# EAGLE design WOW Scanner (EAGLE 6.2)
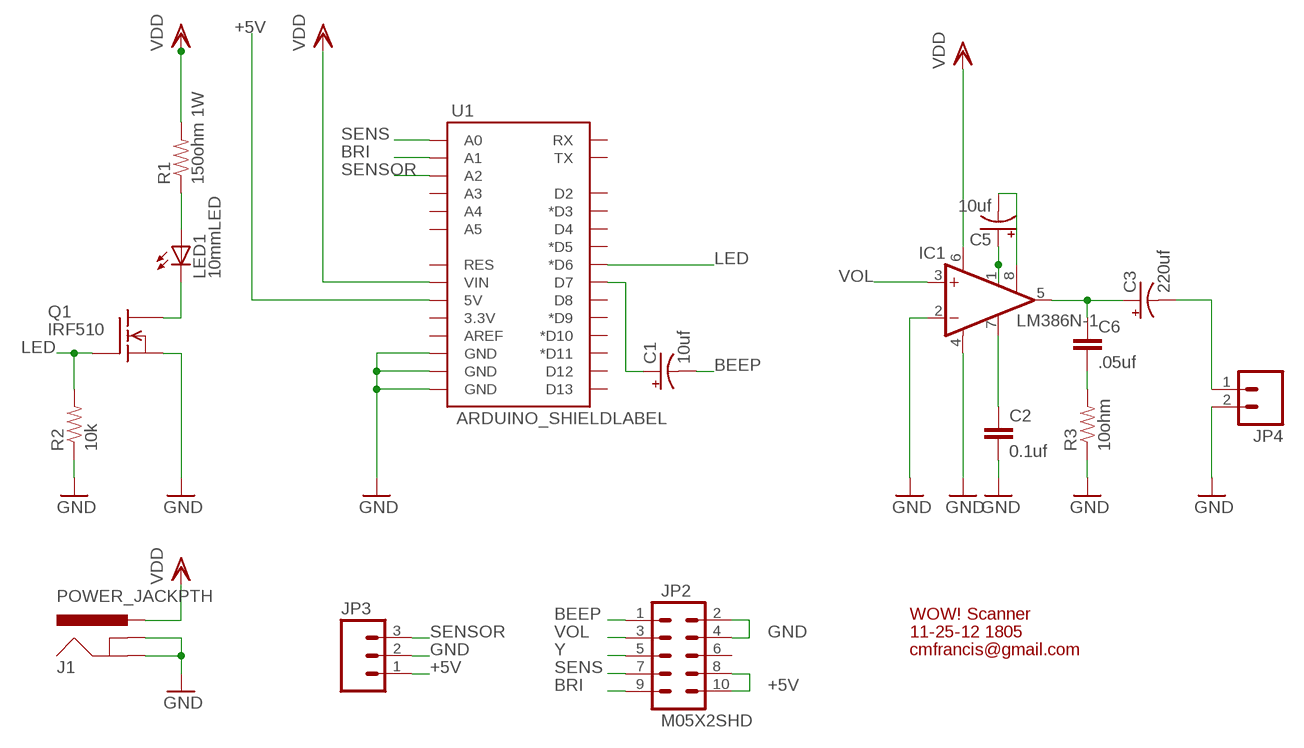
[diagram p0: schematic, sheet 1]

## Parts
C1  10uf  CAP_POLPTH2  [CPOL-RADIAL-10UF-25V]
C2  0.1uf  CAPPTH  [CAP-PTH-SMALL]
C3  220uf  CAP_POLPTH1  [CPOL-RADIAL-100UF-25V]
C5  10uf  CAP_POLPTH2  [CPOL-RADIAL-10UF-25V]
C6  .05uf  CAPPTH  [CAP-PTH-SMALL]
IC1  LM386N-1  [DIL08]
J1  POWER_JACKPTH  [POWER_JACK_PTH]
JP2  M05X2SHD  [2X5-SHROUDED]
JP3  M03JST-PTH  [JST-3-PTH]
JP4  M02PTH  [1X02]
LED1  10mmLED  LED10MM  [LED10MM]
Q1  IRF510  [TO220]
R1  150ohm 1W  RESISTORPTH-1W  [AXIAL-0.6]
R2  10k  RESISTORPTH-1/4W  [AXIAL-0.4]
R3  10ohm  RESISTORPTH-1/4W  [AXIAL-0.4]
U1  ARDUINO_SHIELDLABEL  [DUEMILANOVE_SHIELD]

## Nets
+5V: JP2.8 JP2.10 JP3.1 U1.5V
BEEP: C1.2(-) JP2.1
BRI: JP2.9 U1.A1
GND: C2.2 IC1.2(-IN) IC1.4(GND) J1.GND J1.GNDBREAK JP2.2 JP2.4 JP3.2 JP4.2 Q1.3(S) R2.P$1 R3.P$1 U1.GND@0(GND) U1.GND@1(GND) U1.GND@2(GND)
LED: Q1.1(G) R2.P$2 U1.D6(*D6)
N$1: LED1.A R1.P$1
N$2: LED1.C Q1.2(D)
N$4: C2.1 IC1.7(BYPASS)
N$5: C6.2 R3.P$2
N$6: C3.1(+) C6.1 IC1.5(OUT)
N$7: C5.1(+) IC1.1(GAIN)
N$8: C5.2(-) IC1.8(GAIN)
N$9: C3.2(-) JP4.1
N$12: C1.1(+) U1.D7
SENS: JP2.7 U1.A0
SENSOR: JP3.3 U1.A2
VDD: IC1.6(VS) J1.PWR R1.P$2 U1.VIN
VOL: IC1.3(+IN) JP2.3
Y: JP2.5
Unconnected: JP2.6 U1.3.3V U1.A3 U1.A4 U1.A5 U1.AREF U1.D2 U1.D3(*D3) U1.D4 U1.D5(*D5) U1.D8 U1.D9(*D9) U1.D10(*D10) U1.D11(*D11) U1.D12 U1.D13 U1.RES U1.RX U1.TX

## Notes on the sheet
- WOW! Scanner
- 11-25-12 1805
- cmfrancis@gmail.com

## Library data of the parts
C1 C3 C5 = SparkFun:CAP_POL: Capacitor Polarized These are standard SMD and PTH capacitors. Normally 10uF, 47uF, and 100uF in electrolytic and tantalum varieties. Always verify the external diameter of the through hole cap, it varies with capacity, voltage, and manufacturer. The EIA devices should be standard.
C2 C6 = SparkFun:CAP: Capacitor Standard 0603 ceramic capacitor, and 0.1" leaded capacitor.
IC1 = linear:LM386?-*: Low Voltage Audio Power Amplifier Source: http://cache.national.com/ds/LM/LM386.pdf
J1 = SparkFun:POWER_JACK: Power Jack This is the standard 5.5mm barrel jack for power. The PTH is the most common, proven, reliable, footprint. All others are experimental. The Slot footprint only works if the mill layer is transmitted to the PCB fab house so be warned. Spark Fun Electronics SKU : PRT-00119. Mating wall wart : TOL-00298 (and others)
JP2 = SparkFun:M05X2: Header 5x2 Standard 10-pin dual row 0.1" header. Commonly used with AVR-ISP. Use with Spark Fun Electronics SKU: PRT-00778
JP3 = SparkFun:M03: Header 3 Standard 3-pin 0.1" header. Use with straight break away headers (SKU : PRT-00116), right angle break away headers (PRT-00553), swiss pins (PRT-00743), machine pins (PRT-00117), and female headers (PRT-00115). Molex polarized connector foot print use with SKU : PRT-08232 with associated crimp pins and housings.
JP4 = SparkFun:M02: Header 2 Standard 2-pin 0.1" header. Use with straight break away headers (SKU : PRT-00116), right angle break away headers (PRT-00553), swiss pins (PRT-00743), machine pins (PRT-00117), and female headers (PRT-00115). Molex polarized connector foot print use with SKU : PRT-08233 with associated crimp pins and housings.
LED1 = SparkFun:LED: LEDs Standard schematic elements and footprints for 5mm, 3mm, 1206, and 0603 sized LEDs. 5mm - Spark Fun Electronics SKU : COM-00529 (and others)
Q1 = transistor-fet:IRF510: N-Channel Enhancement MOSFET (HEXFET); 100V; 5,6A; 0,54Ohm
R1-R3 = SparkFun:RESISTOR: Resistor Basic schematic elements and footprints for 0603, 1206, and PTH resistors.
U1 = SparkFun:ARDUINO_SHIELD

## Board
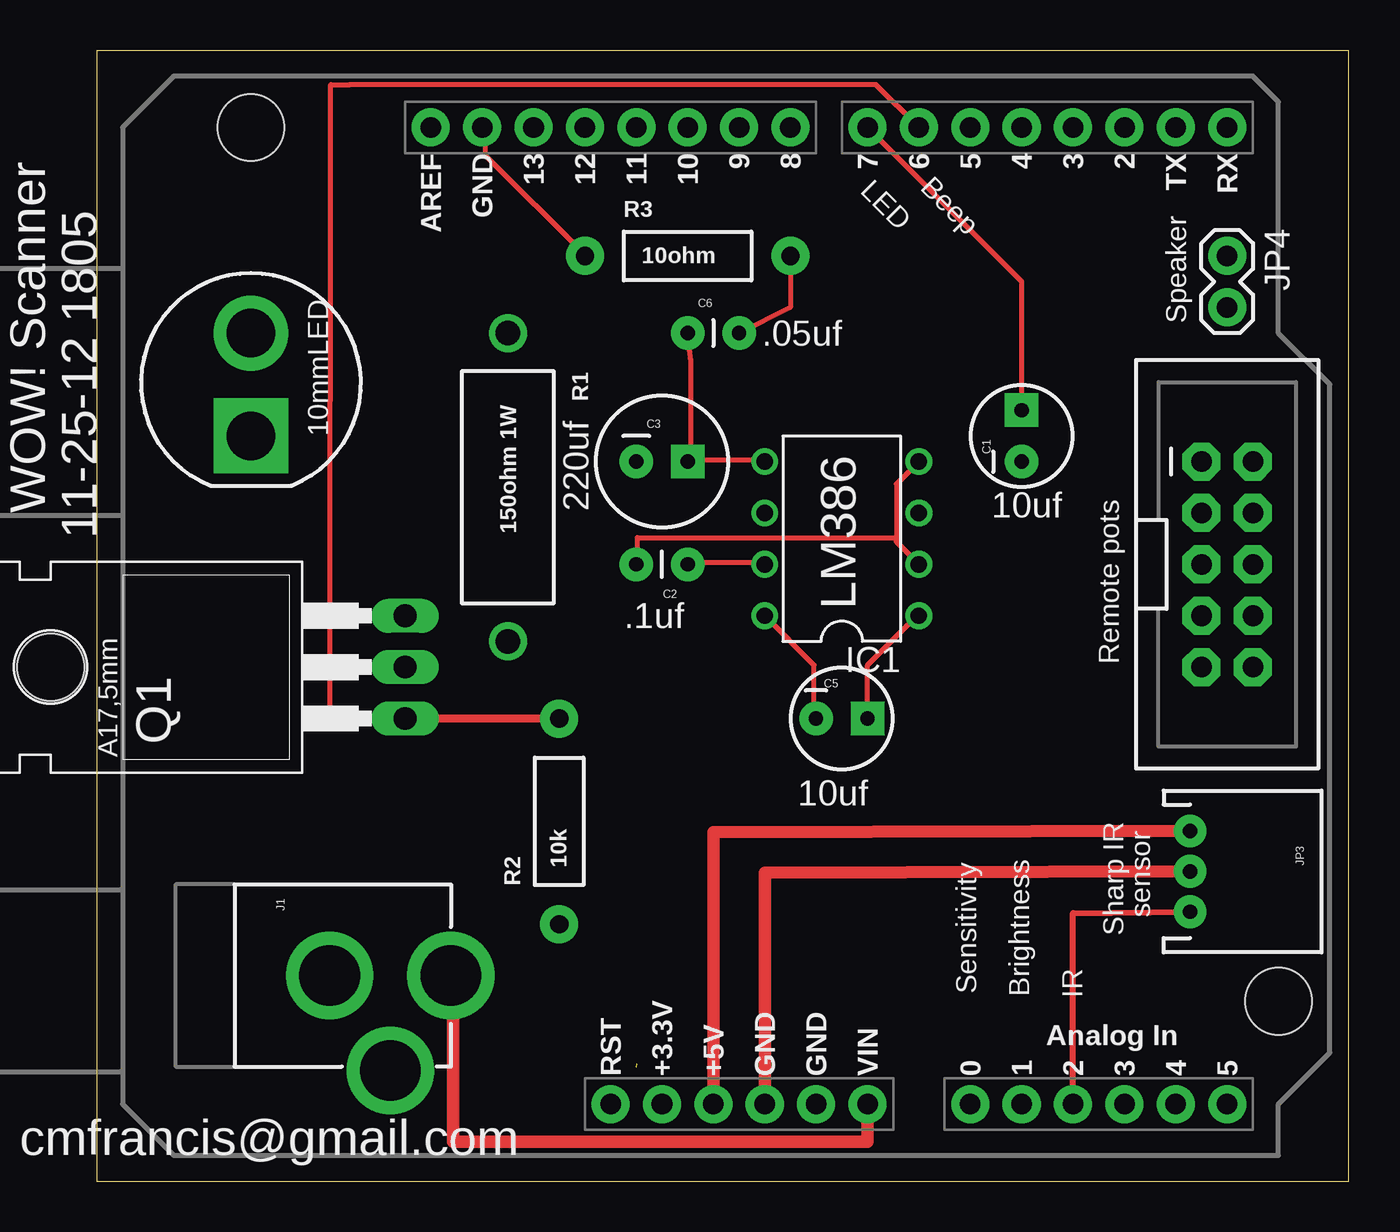
[diagram p1: board, top side]
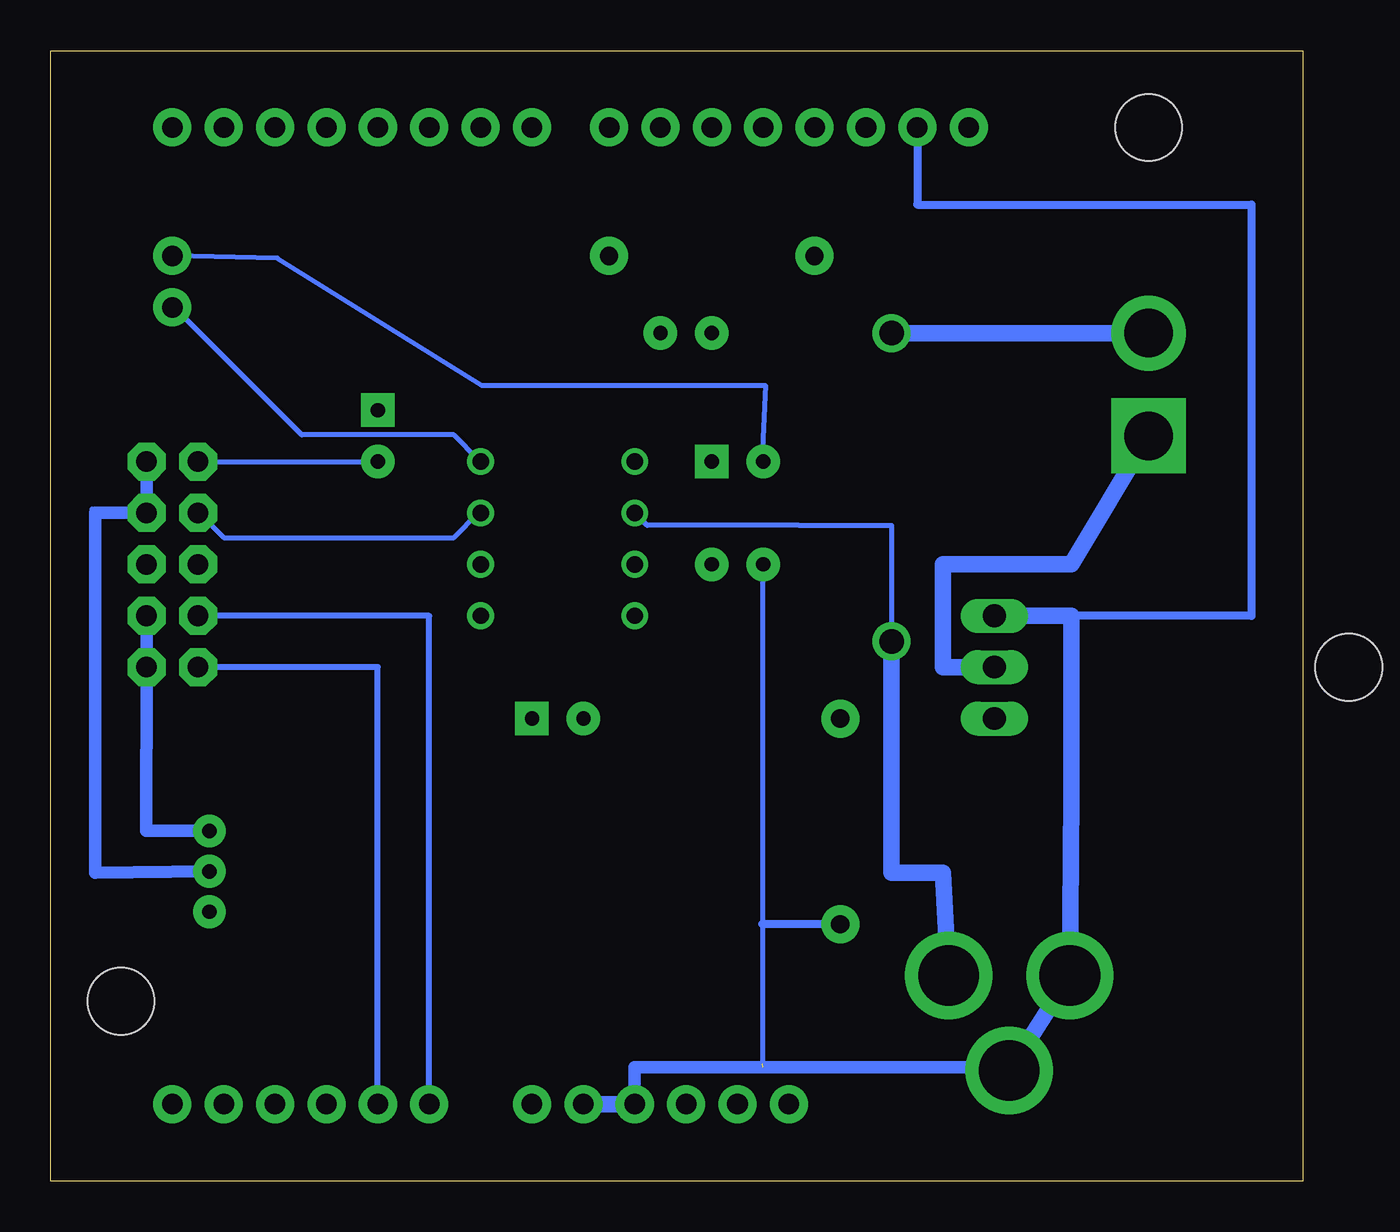
[diagram p2: board, bottom side, seen from below]

Size 61.9 x 55.87 mm. Coordinates in mm from the lower left corner, seen from the top.
Outline: 0,0 61.9,0 61.9,55.87 0,55.87 0,0
Copper layers (1*16): Top 0.035mm / dielectric 1.5mm / Bottom 0.035mm
Design rules: minimum track width 10mil, minimum drill 24mil, track to track 8mil, track to pad 8mil, pad to pad 8mil, via to via 8mil, smd to smd 8mil, copper to edge 40mil, drill to drill 8mil, minimum pad ring 10mil, minimum via ring 8mil, stop-mask expansion 4mil, vias tented up to drill 0mil, thermal gap 10mil

### Footprints (pad centres in the part's own frame; a part is rotated, then mirrored left to right if it is on the bottom)
CPOL-RADIAL-10UF-25V = drill 0.7 pad 1.651 square: 1 1.27,0 | drill 0.7 pad 1.651: 2 -1.27,0
CAP-PTH-SMALL = drill 0.7 pad 1.651: 1 0,0; 2 2.54,0
CPOL-RADIAL-100UF-25V = drill 0.7 pad 1.651 square: 1 1.27,0 | drill 0.7 pad 1.651: 2 -1.27,0
DIL08 = drill 0.813 pad 1.27: 1 -3.81,-3.81; 2 -1.27,-3.81; 3 1.27,-3.81; 4 3.81,-3.81; 5 3.81,3.81; 6 1.27,3.81; 7 -1.27,3.81; 8 -3.81,3.81
POWER_JACK_PTH = drill 2.997 pad 4.318: GND 0,7.7; GNDBREAK 4.7,10.7; PWR 0,13.7
2X5-SHROUDED = drill 1.016 pad 1.88 octagon: 1 -1.27,5.08; 2 1.27,5.08; 3 -1.27,2.54; 4 1.27,2.54; 5 -1.27,0; 6 1.27,0; 7 -1.27,-2.54; 8 1.27,-2.54; 9 -1.27,-5.08; 10 1.27,-5.08
JST-3-PTH = drill 0.7 pad 1.626: 1 -2,-5; 2 0,-5; 3 2,-5
1X02 = drill 1.016 pad 1.88: 1 0,0; 2 2.54,0
LED10MM = drill 2.4 pad 3.7: A 2.54,0 | drill 2.4 pad 3.7 square: C -2.54,0
TO220 = drill 1.118 long: 1 -2.54,-6.35; 2 0,-6.35; 3 2.54,-6.35 | hole 3.302: 0,11.176
AXIAL-0.6 = drill 1.2 pad 1.88: P$1 -7.62,0; P$2 7.62,0
AXIAL-0.4 = drill 0.9 pad 1.88: P$1 -5.08,0; P$2 5.08,0
DUEMILANOVE_SHIELD = drill 1.016 pad 1.88: 3.3V 50.8,26.67; 5V 50.8,29.21; A0 50.8,41.91; A1 50.8,44.45; A2 50.8,46.99; A3 50.8,49.53; A4 50.8,52.07; A5 50.8,54.61; AREF 2.54,15.24; D2 2.54,49.53; D3 2.54,46.99; D4 2.54,44.45; D5 2.54,41.91; D6 2.54,39.37; D7 2.54,36.83; D8 2.54,33.02; D9 2.54,30.48; D10 2.54,27.94; D11 2.54,25.4; D12 2.54,22.86; D13 2.54,20.32; GND@0 50.8,31.75; GND@1 50.8,34.29; GND@2 2.54,17.78; RES 50.8,24.13; RX 2.54,54.61; TX 2.54,52.07; VIN 50.8,36.83 | hole 3.302: 45.72,57.15; 2.54,6.35

### Placement (x,y rotation side)
C1  45.72,36.83 90 top
C2  29.21,30.48 180 top
C3  27.94,35.56 0 top
C5  36.83,22.86 0 top
C6  29.21,41.91 0 top
IC1  36.83,31.75 90 top
J1  3.81,10.16 270 top
JP2  55.88,30.48 0 top
JP3  59.05,15.3 270 top
JP4  55.88,45.72 270 top
LED1  7.62,39.37 90 top
Q1  8.89,25.4 90 top
R1  20.32,34.29 270 top
R2  22.86,17.78 90 top
R3  29.21,45.72 0 top
U1  1.27,54.61 270 top

### Tracks (layer width: path | path; a pad name or v marks a point on that pad's centre or on a via)
+5V
  Top 0.254: 57.2,25.5 JP2.10
  Top 0.61: U1.5V 30.48,17.24 JP3.1
  Bottom 0.61: JP3.1 57.17,17.31 JP2.10 JP2.8
BEEP
  Bottom 0.254: JP2.1 C1.2
BRI
  Bottom 0.305: U1.A1 45.72,25.4 JP2.9
GND  (1 unrouted)
  Top 0.254: 39.52,31.8 39.52,34.44 40.54,35.46 IC1.4 | 39.52,31.8 39.52,31.6 40.54,30.58 IC1.2 | IC1.4 40.74,35.66 IC1.4 | 24.08,45.82 19.2,50.7 19.2,51.92 U1.GND@2 | 39.52,31.8 26.72,31.8 26.72,30.58 C2.2
  Top 0.406: R3.P$1 24.08,45.72 24.08,45.82
  Top 0.61: U1.GND@0 33.02,15.24 JP3.2
  Bottom 0.254: JP4.2 55.78,43.18 49.48,36.88 41.96,36.88 40.74,35.66 IC1.4 | 59.84,16.56 59.69,16.56 | 59.84,26.72 59.69,26.72 | 59.84,17.78 59.69,17.78 | 59.84,33.02 59.69,33.02 59.84,33.22 | C2.2 26.71,30.48 26.71,12.7 26.71,5.81
  Bottom 0.406: U1.GND@2 19.05,48.26 2.54,48.26 2.54,31.75 2.54,27.94 11.43,27.94 | R2.P$1 25.4,12.7 26.71,12.7
  Bottom 0.61: U1.GND@0 33.02,5.63 26.67,5.63 21.59,5.63 15,5.63 15,5.46 J1.GNDBREAK | JP2.4 JP2.2 JP2.4 | JP2.4 59.69,33.02 59.69,26.72 59.69,17.78 59.69,16.56 59.69,15.24 JP3.2
  Bottom 0.813: J1.GNDBREAK J1.GND 11.43,19.05 11.43,27.94 Q1.3 | U1.GND@0 U1.GND@1
LED
  Top 0.254: U1.D6 38.53,54.18 12.51,54.18 12.53,54.18 11.57,54.18 11.54,22.86 Q1.1
  Top 0.406: R2.P$2 Q1.1
N$1
  Bottom 0.813: LED1.A R1.P$1
N$2
  Bottom 0.813: Q1.2 17.78,25.4 17.78,30.48 11.43,30.48 LED1.C
N$4
  Top 0.254: IC1.7 33.02,30.58 29.36,30.58 C2.1
N$5
  Top 0.254: R3.P$2 34.29,43.18 C6.2
N$6
  Top 0.254: 29.36,35.66 33.02,35.66 IC1.5 | 29.36,35.66 C3.1 29.36,35.66 | 29.36,35.66 29.36,40.54 C6.1
N$7
  Top 0.254: C5.1 38.1,25.5 40.54,27.94 IC1.1
N$8
  Top 0.254: IC1.8 35.46,25.5 35.46,22.86 C5.2
N$9
  Bottom 0.254: C3.2 26.72,35.66 26.57,39.32 40.59,39.32 50.7,45.62 JP4.1
N$12
  Top 0.254: C1.1 45.72,44.45 U1.D7
SENS
  Bottom 0.305: U1.A0 43.18,27.94 JP2.7
SENSOR
  Top 0.305: U1.A2 48.26,13.24 JP3.3
VDD
  Top 0.61: U1.VIN 38.1,1.94 17.62,1.94 17.62,10.16 J1.PWR
  Bottom 0.254: IC1.6 32.41,32.41 24.89,32.41 20.32,32.41 R1.P$2
  Bottom 0.813: R1.P$2 20.32,15.24 17.78,15.24 J1.PWR
VOL
  Bottom 0.254: IC1.3 40.74,33.02 41.96,31.8 53.34,31.8 54.56,33.02 JP2.3

### Text on the board
tPlace: Beep | LED | Speaker | .05uf | 220uf | 10mmLED | 10uf | WOW! Scanner | 11-25-12 1805 | LM386 | .1uf | Remote pots | 10uf | sensor | Sharp IR | Sensitivity | Brightness | IR | cmfrancis@gmail.com